# EAGLE design m1284p-40p-breakout board (EAGLE 9.6.2)
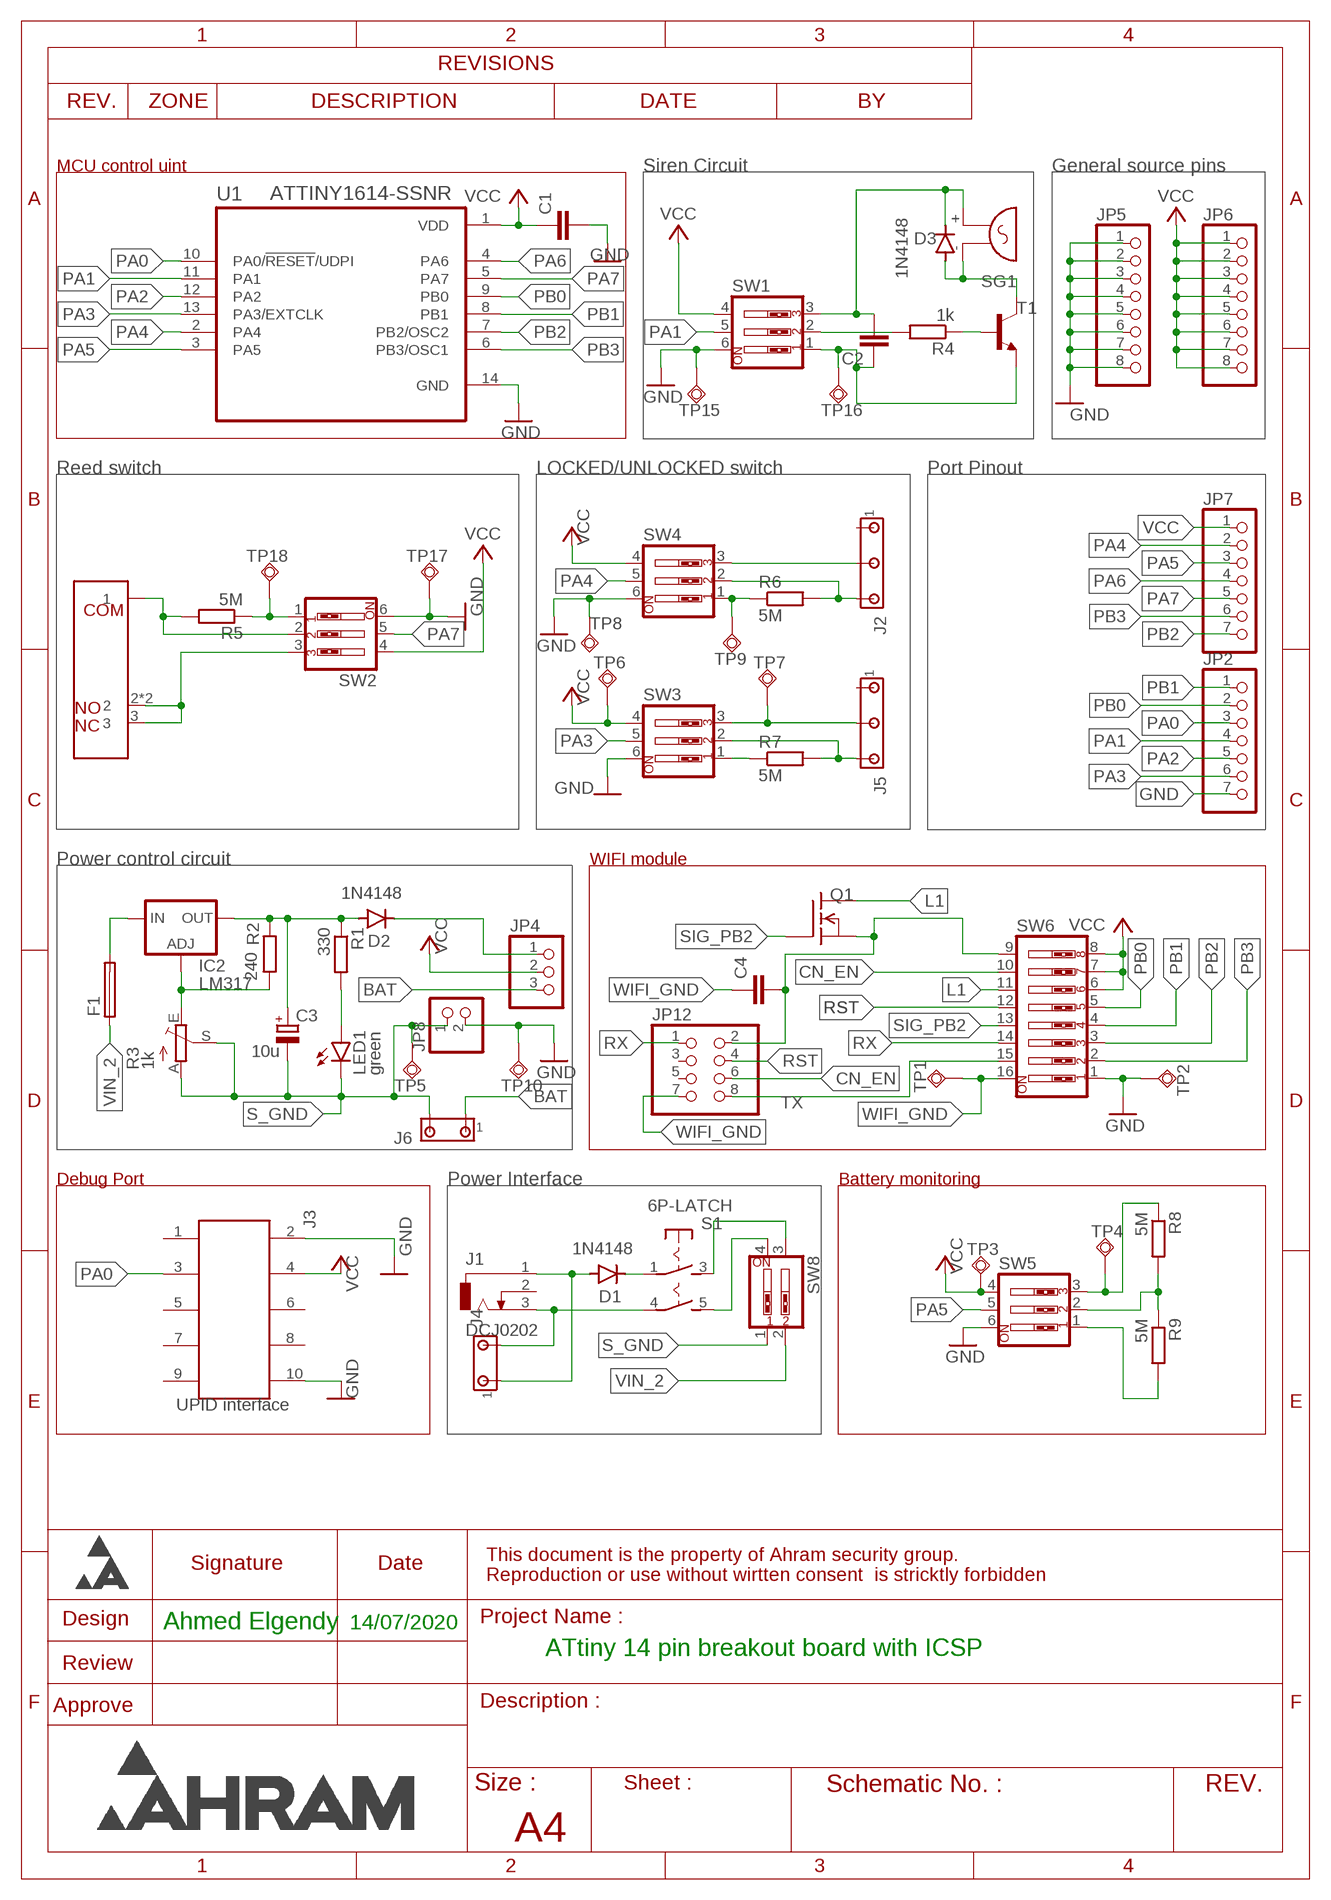
[diagram p0: schematic, sheet 1]

## Parts
C1  C-EU025-030X050  [C025-030X050]
C2  C-EU025-030X050  [C025-030X050]
C3  10u  CPOL-EUE2-4  [E2-4]
C4  C-EU025-030X050  [C025-030X050]
D1  1N4148  1N4148DO35-7  [DO35-7]
D2  1N4148  1N4148DO35-7  [DO35-7]
D3  1N4148  1N4148DO35-7  [DO35-7]
F1  SH22,5A  [SH22,5A]
IC2  LM317  LM317TS  [317TS]
J1  DCJ0202  [DCJ0202]
J2  MTA05-156_MYVSPACE1  [10X05MTA_MYV]
J3  UPID interface  612010235121  [612010235121]
J4  MTA03-100_MYV  [10X03MTA_MYV]
J5  MTA05-156_MYVSPACE1  [10X05MTA_MYV]
J6  MTA03-100_MYV  [10X03MTA_MYV]
JP2  PINHD-1X7  [1X07]
JP4  PINHD-1X3  [1X03]
JP5  PINHD-1X8  [1X08]
JP6  PINHD-1X8  [1X08]
JP7  PINHD-1X7  [1X07]
JP8  PINHD-1X2  [1X02]
JP12  PINHD-2X4  [2X04]
LED1  green  LED3MM  [LED3MM]
Q1  BSS295  [TO92]
R1  330  R-EU_0204/7  [0204/7]
R2  240  R-EU_0204/7  [0204/7]
R3  1k  TRIM_EU-RJ9W  [RJ9W]
R4  1k  R-EU_0204/7  [0204/7]
R5  5M  R-EU_0204/7  [0204/7]
R6  5M  R-EU_0204/7  [0204/7]
R7  5M  R-EU_0204/7  [0204/7]
R8  5M  R-EU_0204/7  [0204/7]
R9  5M  R-EU_0204/7  [0204/7]
S1  6P-LATCH  [TACT-6P-LATCH]
S2  REED_1513  [REED_MYV]
SG1  F/QMX  [F/QMX]
SW1  SW_DIP-3  [EDG-03]
SW2  SW_DIP-3  [EDG-03]
SW3  SW_DIP-3  [EDG-03]
SW4  SW_DIP-3  [EDG-03]
SW5  SW_DIP-3  [EDG-03]
SW6  SW_DIP-8  [EDG-08]
SW8  SW_DIP-2  [EDG-02]
T1  2N2222  [TO18]
TP1  TPSQPAD1-13  [P1-13]
TP2  TPSQPAD1-13  [P1-13]
TP3  TPSQPAD1-13  [P1-13]
TP4  TPSQPAD1-13  [P1-13]
TP5  TPSQPAD1-13  [P1-13]
TP6  TPSQPAD1-13  [P1-13]
TP7  TPSQPAD1-13  [P1-13]
TP8  TPSQPAD1-13  [P1-13]
TP9  TPSQPAD1-13  [P1-13]
TP10  TPSQPAD1-13  [P1-13]
TP15  TPSQPAD1-13  [P1-13]
TP16  TPSQPAD1-13  [P1-13]
TP17  TPSQPAD1-13  [P1-13]
TP18  TPSQPAD1-13  [P1-13]
U1  ATTINY1614-SSNR  [SOIC127P600X175-14N]

## Nets
BAT: J6.1 JP4.3
CN_EN: JP12.6 SW6.10
GND: C1.2 J3.2 J3.10 JP2.7 JP5.1 JP5.2 JP5.3 JP5.4 JP5.5 JP5.6 JP5.7 JP5.8 JP8.2 SW1.6 SW2.6 SW3.6 SW4.6 SW5.6 SW6.1 TP2.TP TP8.TP TP10.TP TP15.TP TP17.TP U1.14(GND)
L1: Q1.3(D) SW6.11
N$1: D1.C S1.1
N$2: C3.+ D2.A IC2.2(OUT) R1.1 R2.2
N$3: D1.A J1.1 J4.1
N$4: LED1.A R1.2
N$5: R4.1 T1.2(B)
N$6: IC2.1(ADJ) R2.1 R3.E
N$7: J1.3 J4.3 S1.4
N$8: F1.2 IC2.3(IN)
N$9: J2.5 R6.2 SW4.2
N$10: R4.2 SW1.2
N$11: R5.2 S2.1 SW2.2
N$14: R8.2 R9.1 SW5.2
N$16: S1.5 SW8.4
N$18: R9.2 SW5.1
N$19: R5.1 SW2.1 TP18.TP
N$20: J2.3 SW4.3
N$21: R6.1 SW4.1 TP9.TP
N$22: D2.C JP4.1
N$23: C2.2 D3.C SG1.+ SW1.3
N$24: C2.1 SW1.1 T1.1(E) TP16.TP
N$25: S2.2 S2.3 S2.4 SW2.3
N$26: R8.1 SW5.3 TP4.TP
N$27: R7.1 SW3.1
N$28: D3.A SG1.- T1.3(C)
N$29: J5.5 R7.2 SW3.2
N$30: J5.3 SW3.3 TP7.TP
N$32: C4.2 JP12.2 Q1.1(S) SW6.9
PA0: J3.3 JP2.3 U1.10(PA0/!RESET!/UDPI)
PA1: JP2.4 SW1.5 U1.11(PA1)
PA2: JP2.5 U1.12(PA2)
PA3: JP2.6 SW3.5 U1.13(PA3/EXTCLK)
PA4: JP7.2 SW4.5 U1.2(PA4)
PA5: JP7.3 SW5.5 U1.3(PA5)
PA6: JP7.4 U1.4(PA6)
PA7: JP7.5 SW2.5 U1.5(PA7)
PB0: JP2.2 SW6.5 U1.9(PB0)
PB1: JP2.1 SW6.4 U1.8(PB1)
PB2: JP7.7 SW6.3 U1.7(PB2/OSC2)
PB3: JP7.6 SW6.2 U1.6(PB3/OSC1)
RST: JP12.4 SW6.12
RX: JP12.1 SW6.14
S_GND: C3.- J6.3 JP8.1 LED1.K(C) R3.A R3.S SW8.1 TP5.TP
SIG_PB2: Q1.2(G) SW6.13
TX: JP12.8 SW6.15
VCC: C1.1 J3.4 JP4.2 JP6.1 JP6.2 JP6.3 JP6.4 JP6.5 JP6.6 JP6.7 JP6.8 JP7.1 SW1.4 SW2.4 SW3.4 SW4.4 SW5.4 SW6.6 SW6.7 SW6.8 TP3.TP TP6.TP U1.1(VDD)
VIN_1: S1.3 SW8.3
VIN_2: F1.1 SW8.2
WIFI_GND: C4.1 JP12.7 SW6.16 TP1.TP
Unconnected: J1.2 J2.1 J3.1 J3.5 J3.6 J3.7 J3.8 J3.9 J5.1 JP12.3 JP12.5

## Notes on the sheet
- MCU control uint | Siren Circuit | General source pins
- Reed switch | LOCKED/UNLOCKED switch | Port Pinout
- Power control circuit | WIFI module
- Debug Port | Power Interface | Battery monitoring
- Ahmed Elgendy | 14/07/2020
- ATtiny 14 pin breakout board with ICSP

## Library data of the parts
C1 C2 C4 = rcl:C-EU: CAPACITOR, European symbol; SPICEPREFIX: C
C3 = rcl:CPOL-EU: POLARIZED CAPACITOR, European symbol; SPICEPREFIX: C
D1-D3 = diode:1N4148: DIODE high speed (Philips)
F1 = fuse:SH22,5A: FUSE HOLDER grid 22,5mm, isolated cap OGN0031 8201, Schurter (Buerklin); MPN: 0031.7701.11; OC_FARNELL: unknown; OC_NEWARK: 04F1224
IC2 = v-reg:LM317TS: VOLTAGE REGULATOR
J1 = con-jack:DCJ0202: DC POWER JACK Source: DCJ0202.pdf; OC_FARNELL: unknown; OC_NEWARK: unknown
J2 J5 = con-amp_edit:MTA05-156_MYV: AMP connector
J3 = Wire-to-Board (rev17c):612010235121: WR-BHD 2.54mm Male Box Header High Temperature, 10 Pins=>Code : Con_WTB_BHD_2.54_Male_THT_RS_612010235121 <http://katalog.we-online.de/media/thumbs2/eican/thb_Con_WTB_BHD_2.54_Male_THT_RS_6120xx235121_pf2.jpg> Details see: http://katalog.we-online.de/en/em/612_0xx_235_121 Created 2014-06-05, Karrer Zheng 2014 (C) Würth Elektronik
J4 J6 = con-amp_edit:MTA03-100_MYV: AMP connector
JP2 JP7 = pinhead:PINHD-1X7: PIN HEADER
JP4 = pinhead:PINHD-1X3: PIN HEADER
JP5 JP6 = pinhead:PINHD-1X8: PIN HEADER
JP8 = pinhead:PINHD-1X2: PIN HEADER
JP12 = pinhead:PINHD-2X4: PIN HEADER
LED1 = led:LED: LED OSRAM: - CHIPLED LG R971, LG N971, LY N971, LG Q971, LY Q971, LO R971, LY R971 LH N974, LH R974 LS Q976, LO Q976, LY Q976 LO Q996 - Hyper CHIPLED LW Q18S LB Q993, LB Q99A, LB R99A - SideLED LS A670, LO A670, LY A670, LG A670, LP A670 LB A673, LV A673, LT A673, LW A673 LH A674 LY A675 LS A676, LA A676, LO A676, LY A676, LW A676 LS A679, LY A679, LG A679 - Hyper Micro SIDELED® LS Y876, LA Y876, LO Y876, LY Y876 LT Y87S - SmartLED LW L88C, LW L88S LB L89C, LB L89S, LG L890 LS L89K, LO L89K, LY L89K LS L896, LA L896, LO L896, LY L896 - TOPLED LS T670, LO T670, LY T670, LG T670, LP T670 LSG T670, LSP T670, LSY T670, LOP T670, LYG T670 LG T671, LOG T671, LSG T671 LB T673, LV T673, LT T673, LW T673 LH T674 LS T676, LA T676, LO T676, LY T676, LB T676, LH T676, LSB T676, LW T676 LB T67C, LV T67C, LT T67C, LS T67K, LO T67K, LY T67K, LW E67C LS E67B, LA E67B, LO E67B, LY E67B, LB E67C, LV E67C, LT E67C LW T67C LS T679, LY T679, LG T679 LS T770, LO T770, LY T770, LG T770, LP T770 LB T773, LV T773, LT T773, LW T773 LH T774 LS E675, LA E675, LY E675, LS T675 LS T776, LA T776, LO T776, LY T776, LB T776 LHGB T686 LT T68C, LB T68C - Hyper Mini TOPLED® LB M676 - Mini TOPLED Santana® LG M470 LS M47K, LO M47K, LY M47K Source: http://www.osram.convergy.de LUXEON: - LUMILED® LXK2-PW12-R00, LXK2-PW12-S00, LXK2-PW14-U00, LXK2-PW14-V00 LXK2-PM12-R00, LXK2-PM12-S00, LXK2-PM14-U00 LXK2-PE12-Q00, LXK2-PE12-R00, LXK2-PE12-S00, LXK2-PE14-T00, LXK2-PE14-U00 LXK2-PB12-K00, LXK2-PB12-L00, LXK2-PB12-M00, LXK2-PB14-N00, LXK2-PB14-P00, LXK2-PB14-Q00 LXK2-PR12-L00, LXK2-PR12-M00, LXK2-PR14-Q00, LXK2-PR14-R00 LXK2-PD12-Q00, LXK2-PD12-R00, LXK2-PD12-S00 LXK2-PH12-R00, LXK2-PH12-S00 LXK2-PL12-P00, LXK2-PL12-Q00, LXK2-PL12-R00 Source: www.luxeon.com KINGBRIGHT: KA-3528ASYC Source: www.kingbright.com
Q1 = transistor-fet_myv:BSS295: N-Channel Enhancement MOSFET not checked
R1 R2 R4-R9 = rcl:R-EU_: RESISTOR, European symbol; SPICEPREFIX: R
R3 = pot:TRIM_EU-: POTENTIOMETER
S1 = switches-misc v2.2:6P-LATCH
S2 = reed_MYV:REED_1513
SG1 = buzzer:F/QMX: BUZZER Source: Buerklin; OC_FARNELL: unknown; OC_NEWARK: unknown
SW1-SW5 = special:SW_DIP-3: DIP SWITCH
SW6 = special:SW_DIP-8: DIP SWITCH
SW8 = special:SW_DIP-2: DIP SWITCH
T1 = transistor:2N2222: NPN TRANSISTOR
TP1-TP10 TP15-TP18 = testpad:TPSQ: Test pad
U1 = ATTINY1614-SSNR:ATTINY1614-SSNR: 20MHz, SOIC, 85C, Green, 14 SOIC .150in T/R; ARROW_ELECTRONICS-PURCHASE-URL: https://snapeda.com/shop?store=Arrow+Electronics&id=4817174; AVAILABILITY: Unavailable; DESCRIPTION: IC MCU 8BIT 16KB FLASH 14SOIC; DIGIKEY-PURCHASE-URL: https://snapeda.com/shop?store=DigiKey&id=4817174; MF: Microchip Technology; MOUSER-PURCHASE-URL: https://snapeda.com/shop?store=Mouser&id=4817174; MP: ATTINY1614-SSNR; PACKAGE: None; PRICE: None

## Board
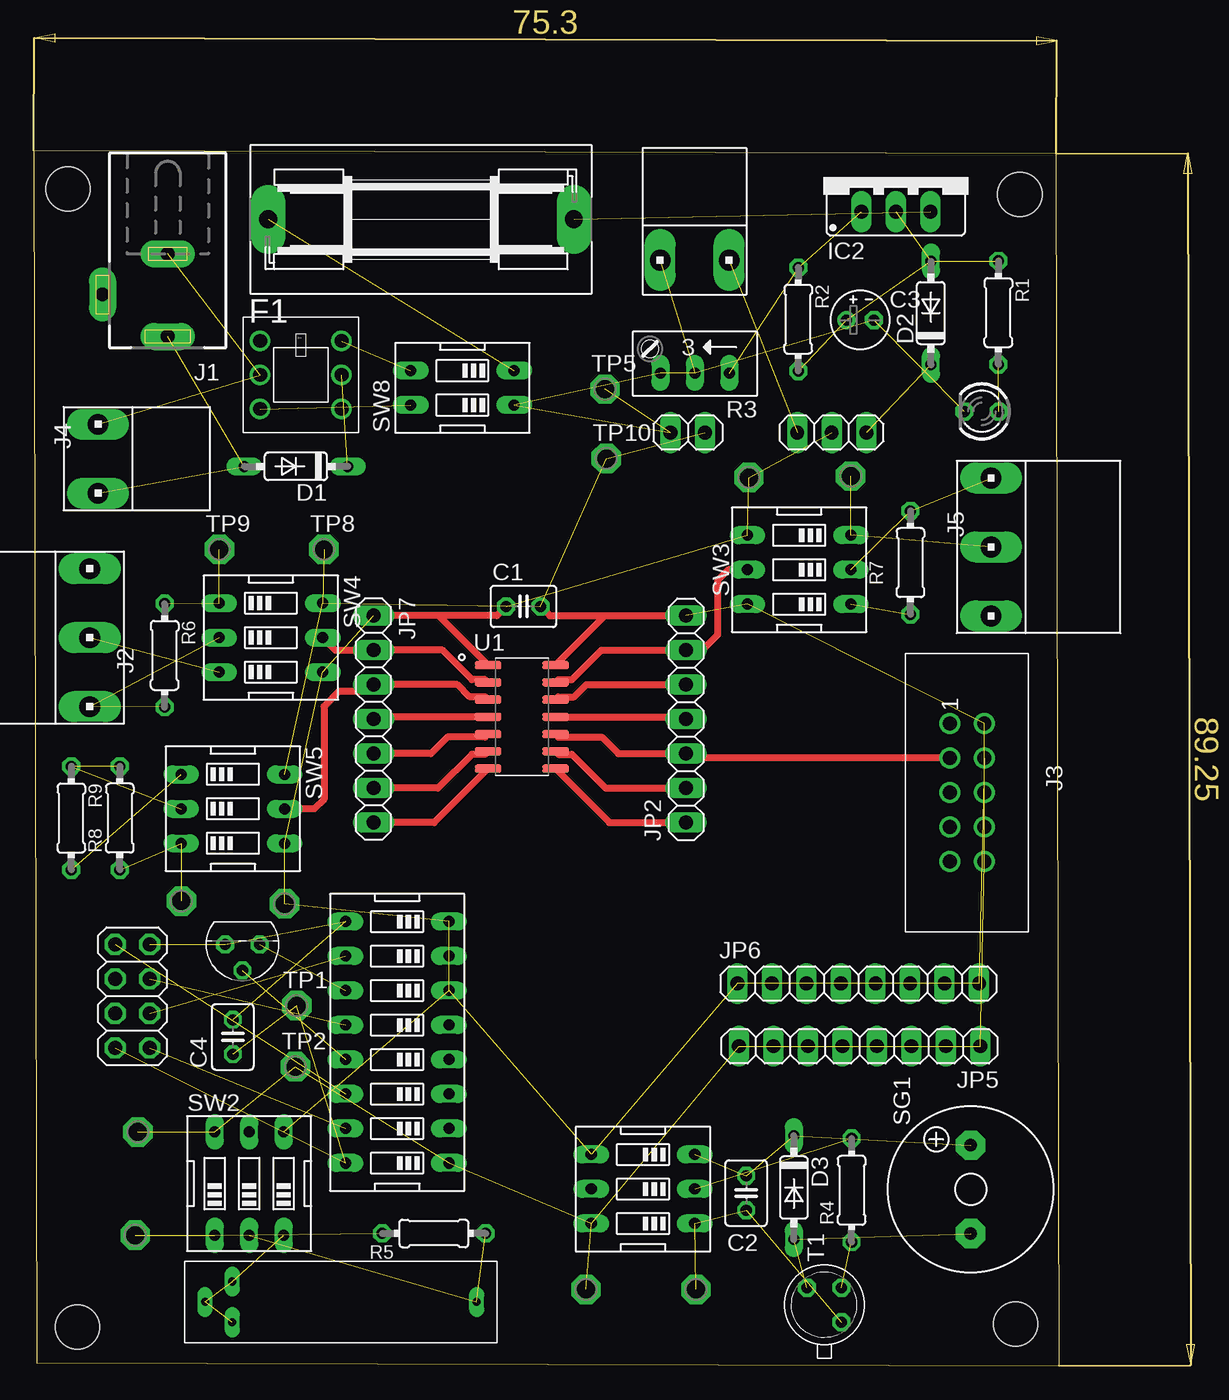
[diagram p1: board, top side]
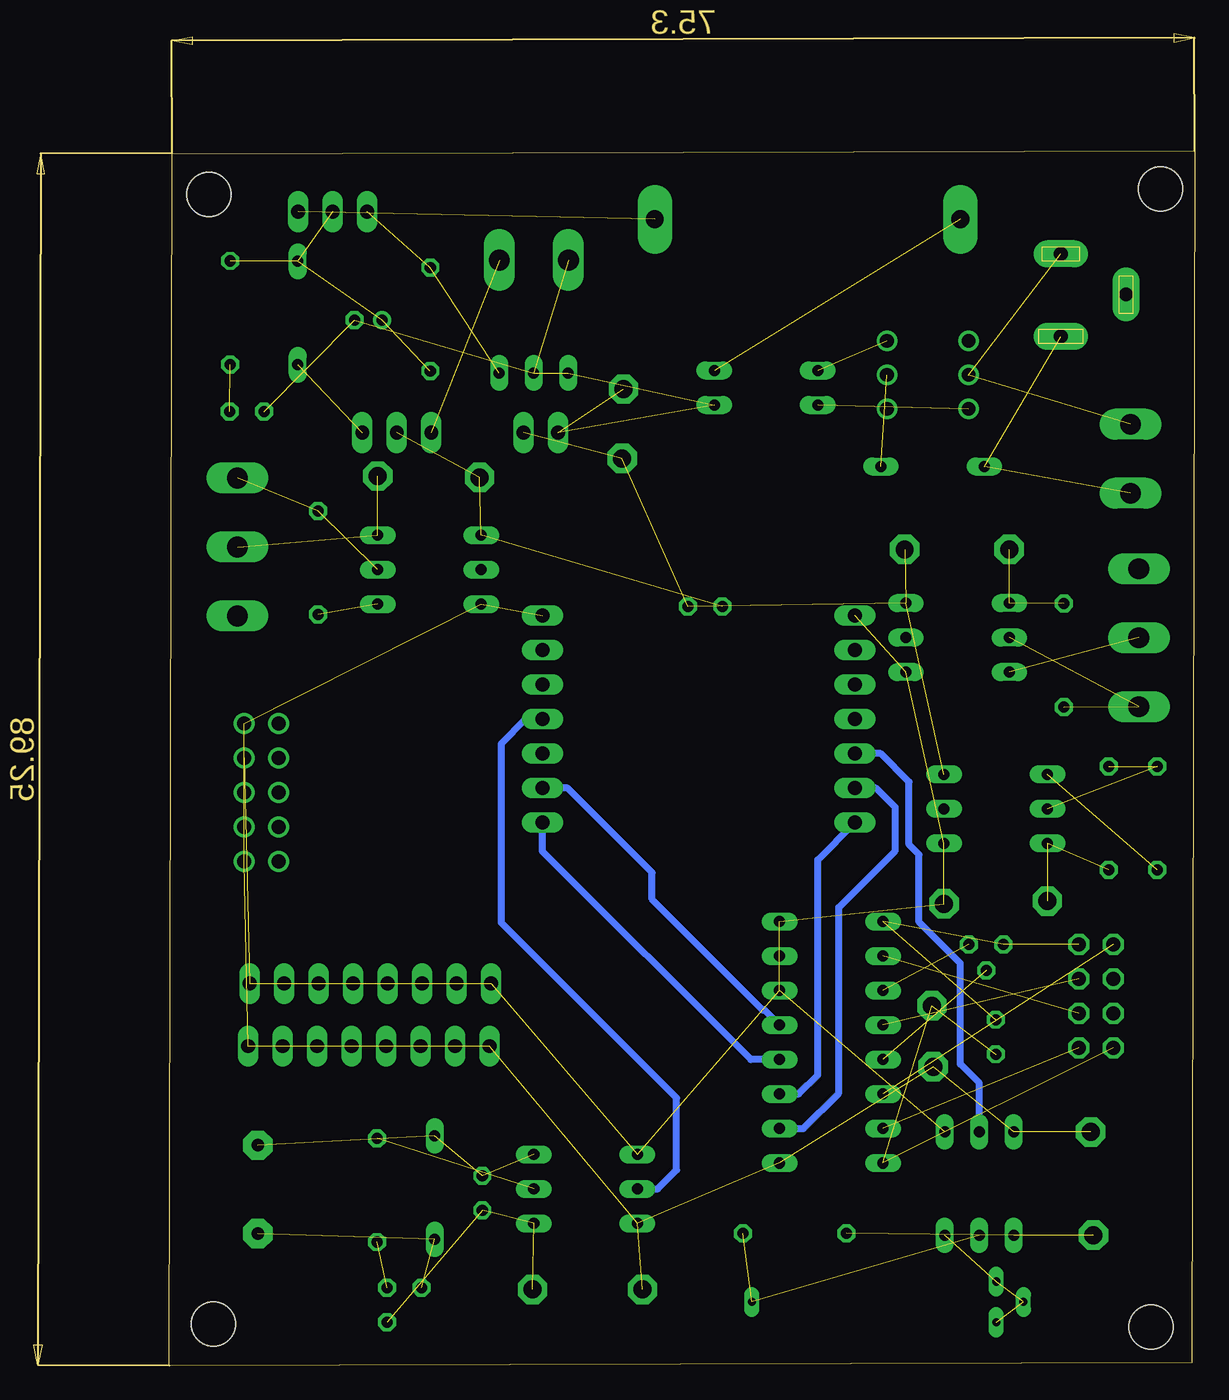
[diagram p2: board, bottom side, seen from below]

Size 75.5 x 89.45 mm. Coordinates in mm from the lower left corner, seen from the top.
Outline: 0.2,0.2 75.5,0 75.3,89.25 0,89.45 0.2,0.2
Copper layers (1*16): Top 0.035mm / dielectric 1.5mm / Bottom 0.035mm
Design rules "default *": minimum track width 20mil, minimum drill 0.35mm, track to track 20mil, track to pad 20mil, pad to pad 20mil, via to via 20mil, smd to smd 20mil, copper to edge 40mil, drill to drill 6mil, minimum pad ring 10mil, minimum via ring 8mil, stop-mask expansion 4mil, vias tented up to drill 0mil, thermal gap 10mil
Holes 3.25 mm at 72.27,3.05 3.2,2.85 2.5,86.65 72.6,86.25

### Footprints (pad centres in the part's own frame; a part is rotated, then mirrored left to right if it is on the bottom)
C025-030X050 = drill 0.813 octagon: 1 -1.27,0; 2 1.27,0
E2-4 = drill 0.813 pad 1.27: + -1.016,0 | drill 0.813 pad 1.27 octagon: - 1.016,0
DO35-7 = drill 0.813 long: A 3.81,0; C -3.81,0
SH22,5A = drill 1.321 pad 2.54 long: 1 -11.252,0; 2 11.252,0
317TS = drill 1.016 long: 1 -2.54,-2.54; 2 0,-2.54; 3 2.54,-2.54
DCJ0202 = drill 1 pad 2 long: 1 0,3.1; 2 4.8,0; 3 0,-3
10X05MTA_MYV = drill 1.524 long: 1 5.08,0; 3 0,0; 5 -5.08,0
612010235121 = drill 1.02: 1 -5.08,-1.27; 2 -5.08,1.27; 3 -2.54,-1.27; 4 -2.54,1.27; 5 0,-1.27; 6 0,1.27; 7 2.54,-1.27; 8 2.54,1.27; 9 5.08,-1.27; 10 5.08,1.27
10X03MTA_MYV = drill 1.524 long: 1 2.54,0; 3 -2.54,0
1X07 = drill 1.016 long: 1 -7.62,0; 2 -5.08,0; 3 -2.54,0; 4 0,0; 5 2.54,0; 6 5.08,0; 7 7.62,0
1X03 = drill 1.016 long: 1 -2.54,0; 2 0,0; 3 2.54,0
1X08 = drill 1.016 long: 1 -8.89,0; 2 -6.35,0; 3 -3.81,0; 4 -1.27,0; 5 1.27,0; 6 3.81,0; 7 6.35,0; 8 8.89,0
1X02 = drill 1.016 long: 1 -1.27,0; 2 1.27,0
2X04 = drill 1.016 octagon: 1 -3.81,-1.27; 2 -3.81,1.27; 3 -1.27,-1.27; 4 -1.27,1.27; 5 1.27,-1.27; 6 1.27,1.27; 7 3.81,-1.27; 8 3.81,1.27
LED3MM = drill 0.813 octagon: A -1.27,0; K 1.27,0
TO92 = drill 0.813 octagon: 1 1.27,0; 2 0,1.905; 3 -1.27,0
0204/7 = drill 0.813 octagon: 1 -3.81,0; 2 3.81,0
RJ9W = drill 0.813 long: A 2.54,0.635; E -2.54,0.635; S 0,0.635
TACT-6P-LATCH = drill 1: 1 0,-3; 2 -2.5,-3; 3 2.5,-3; 4 0,3; 5 -2.5,3; 6 2.5,3
REED_MYV = drill 0.6 long: 1 0,0; 2 0,20; 3 -1.5,18; 4 1.5,18
F/QMX = drill 0.914 pad 2.159 octagon: + 3.251,0; - -3.251,0
EDG-03 = drill 0.813 long: 1 -2.54,-3.81; 2 0,-3.81; 3 2.54,-3.81; 4 2.54,3.81; 5 0,3.81; 6 -2.54,3.81
EDG-08 = drill 0.813 long: 1 -8.89,-3.81; 2 -6.35,-3.81; 3 -3.81,-3.81; 4 -1.27,-3.81; 5 1.27,-3.81; 6 3.81,-3.81; 7 6.35,-3.81; 8 8.89,-3.81; 9 8.89,3.81; 10 6.35,3.81; 11 3.81,3.81; 12 1.27,3.81; 13 -1.27,3.81; 14 -3.81,3.81; 15 -6.35,3.81; 16 -8.89,3.81
EDG-02 = drill 0.813 long: 1 -1.27,-3.81; 2 1.27,-3.81; 3 1.27,3.81; 4 -1.27,3.81
TO18 = drill 0.813 octagon: 1 -1.27,-1.27; 2 1.27,-1.27; 3 1.27,1.27
P1-13 = drill 1.321 pad 2.159 octagon: TP 0,0
SOIC127P600X175-14N = smd 1.95 x 0.59: 1 -2.48,3.81; 2 -2.48,2.54; 3 -2.48,1.27; 4 -2.48,0; 5 -2.48,-1.27; 6 -2.48,-2.54; 7 -2.48,-3.81; 8 2.48,-3.81; 9 2.48,-2.54; 10 2.48,-1.27; 11 2.48,0; 12 2.48,1.27; 13 2.48,2.54; 14 2.48,3.81

### Placement (x,y rotation side)
C1  36.05,55.9 0 top
C2  52.45,12.7 90 top
C3  60.85,76.99 0 top
C4  14.65,24.2 90 top
D1  19.29,66.21 180 top
D2  66.05,77.5 90 top
D3  55.96,13.11 270 top
F1  28.5,84.4 0 top
IC2  63.47,87.5 0 top
J1  9.85,78.87 180 top
J2  4.11,53.59 90 top
J3  68.72,42.2 270 top
J4  4.72,66.77 270 top
J5  70.48,60.27 270 top
J6  48.65,81.4 0 top
JP2  48.02,47.6 90 top
JP4  58.75,68.7 180 top
JP5  60.8,23.52 180 top
JP6  60.71,28.13 0 top
JP7  25.01,47.6 270 top
JP8  48.15,68.7 0 top
JP12  7.25,27.2 270 top
LED1  69.8,70.26 180 top
Q1  15.35,31 180 top
R1  71.02,77.53 270 top
R2  56.28,77.05 270 top
R3  48.67,73.72 180 top
R4  60.22,12.9 90 top
R5  29.45,9.73 0 top
R6  9.62,52.3 270 top
R7  64.55,59.12 90 top
R8  6.33,40.31 90 top
R9  2.75,40.31 270 top
S1  19.65,72.94 90 top
S2  32.6,4.68 90 top
SG1  68.98,12.97 90 top
SW1  44.85,13 90 top
SW2  15.85,13.4 0 top
SW3  56.35,58.6 90 top
SW4  17.45,53.6 270 top
SW5  14.65,41 270 top
SW6  26.75,23.8 90 top
SW8  31.55,72 90 top
T1  58.2,4.46 90 top
TP1  19.35,26.5 0 top
TP2  19.25,22 0 top
TP3  18.45,34 0 top
TP4  10.85,34.2 0 top
TP5  42.05,71.9 0 top
TP6  52.65,65.4 270 top
TP7  60.15,65.5 270 top
TP8  21.35,60.1 0 top
TP9  13.65,60.1 0 top
TP10  42.15,66.8 0 top
TP15  40.65,5.6 90 top
TP16  48.75,5.6 90 top
TP17  7.65,17.2 0 top
TP18  7.45,9.6 0 top
U1  35.93,47.76 0 top

### Tracks (layer width: path | path; a pad name or v marks a point on that pad's centre or on a via)
BAT  (1 unrouted)
CN_EN  (1 unrouted)
GND  (22 unrouted)
  Top 0.508: U1.14 42.06,55.22 | 42.06,55.22 JP2.7 | C1.2 38,55.22 42.06,55.22
L1  (1 unrouted)
N$1  (1 unrouted)
N$2  (4 unrouted)
N$3  (2 unrouted)
N$4  (1 unrouted)
N$5  (1 unrouted)
N$6  (2 unrouted)
N$7  (2 unrouted)
N$8  (1 unrouted)
N$9  (2 unrouted)
N$10  (1 unrouted)
N$11  (2 unrouted)
N$14  (2 unrouted)
N$16  (1 unrouted)
N$18  (1 unrouted)
N$19  (2 unrouted)
N$20  (1 unrouted)
N$21  (2 unrouted)
N$22  (1 unrouted)
N$23  (3 unrouted)
N$24  (3 unrouted)
N$25  (3 unrouted)
N$26  (2 unrouted)
N$27  (1 unrouted)
N$28  (2 unrouted)
N$29  (2 unrouted)
N$30  (2 unrouted)
N$32  (3 unrouted)
PA0
  Top 0.508: U1.10 38.62,46.28 41.81,46.28 43.03,45.06 47.75,45.06 | 47.75,45.06 JP2.3 | J3.3 48.08,44.73 47.75,45.06
PA1
  Top 0.508: U1.11 47.86,47.76 JP2.4
  Bottom 0.508: SW1.5 39.55,13 38.15,14.4 38.15,19.7 51.05,32.6 51.05,45.8 49.25,47.6 JP2.4
PA2
  Top 0.508: U1.12 38.62,49.24 39.78,49.24 40.68,50.14 JP2.5
PA3
  Top 0.508: U1.13 38.62,50.51 39.61,50.51 41.78,52.68 JP2.6 49.23,52.68 50.35,53.8 50.35,57.8 51.15,58.6 SW3.5
PA4
  Top 0.508: U1.2 33.24,50.51 32.25,50.51 30.08,52.68 JP7.2 22.18,52.68 SW4.5
PA5
  Top 0.508: U1.3 33.24,49.24 32.08,49.24 31.18,50.14 JP7.3 24.51,49.64 22.45,49.64 21.35,48.54 21.35,41.7 20.65,41 SW5.5
PA6
  Top 0.508: U1.4 25.17,47.76 JP7.4
PA7
  Top 0.508: U1.5 33.24,46.28 30.45,46.28 29.23,45.06 JP7.5
  Bottom 0.508: SW2.5 15.85,20.8 17.25,22.2 17.25,29.62 20.29,32.66 20.29,37.62 21.03,38.36 21.03,42.98 23.11,45.06 JP7.5
PB0
  Top 0.508: U1.9 38.62,45.01 39.61,45.01 42.1,42.52 JP2.2
  Bottom 0.508: SW6.5 31.68,26.19 31.81,26.19 39.95,34.33 39.95,36.3 46.17,42.52 JP2.2
PB1
  Top 0.508: U1.8 42.38,39.98 JP2.1
  Bottom 0.508: SW6.4 32.68,22.53 48.02,37.87 JP2.1
PB2
  Top 0.508: U1.7 29.48,39.98 JP7.7
  Bottom 0.508: SW6.3 29.16,19.99 27.75,21.4 27.75,37.24 JP7.7
PB3
  Top 0.508: U1.6 33.24,45.01 32.25,45.01 29.76,42.52 JP7.6
  Bottom 0.508: SW6.2 28.8,17.45 26.2,20.05 26.2,33.75 22.05,37.9 22.05,41.1 23.47,42.52 JP7.6
RST  (1 unrouted)
RX  (1 unrouted)
S_GND  (7 unrouted)
SIG_PB2  (1 unrouted)
TX  (1 unrouted)
VCC  (20 unrouted)
  Top 0.508: U1.1 29.8,55.22 | 29.8,55.22 JP7.1 | C1.1 34.1,55.22 29.8,55.22
VIN_1  (1 unrouted)
VIN_2  (1 unrouted)
WIFI_GND  (3 unrouted)